# EAGLE design fb_in_8_230V_03 (EAGLE 4.16)
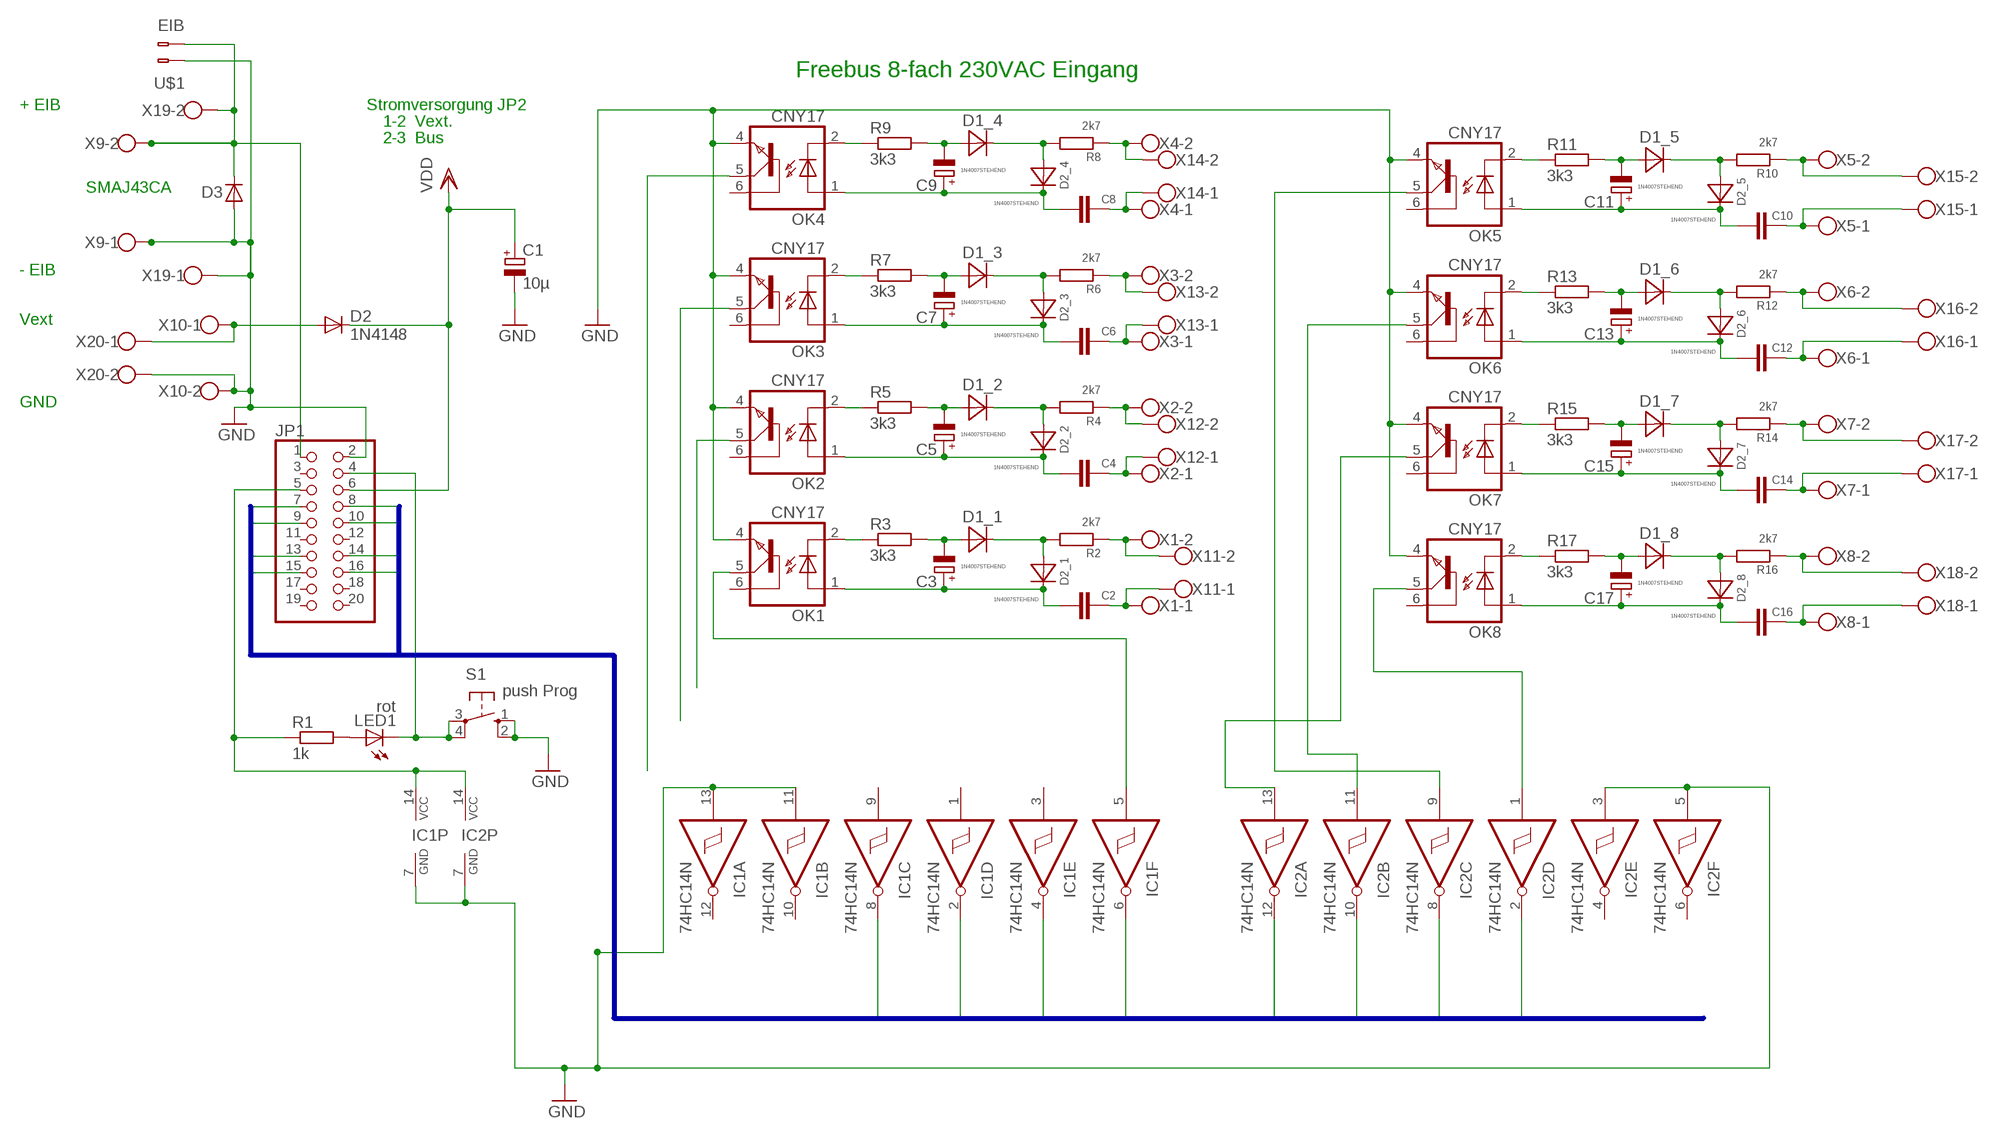
[diagram p0: schematic, sheet 1]

## Parts
C1  10µ  CPOL-EUE3.5-8  [E3,5-8]
C2  C-EU075-063X106  [C075-063X106]
C3  CPOL-EUE2-4  [E2-4]
C4  C-EU075-063X106  [C075-063X106]
C5  CPOL-EUE2-4  [E2-4]
C6  C-EU075-063X106  [C075-063X106]
C7  CPOL-EUE2-4  [E2-4]
C8  C-EU075-063X106  [C075-063X106]
C9  CPOL-EUE2-4  [E2-4]
C10  C-EU075-063X106  [C075-063X106]
C11  CPOL-EUE2-4  [E2-4]
C12  C-EU075-063X106  [C075-063X106]
C13  CPOL-EUE2-4  [E2-4]
C14  C-EU075-063X106  [C075-063X106]
C15  CPOL-EUE2-4  [E2-4]
C16  C-EU075-063X106  [C075-063X106]
C17  CPOL-EUE2-4  [E2-4]
D1_1  1N4007STEHEND  [RAD2,5]
D1_2  1N4007STEHEND  [RAD2,5]
D1_3  1N4007STEHEND  [RAD2,5]
D1_4  1N4007STEHEND  [RAD2,5]
D1_5  1N4007STEHEND  [RAD2,5]
D1_6  1N4007STEHEND  [RAD2,5]
D1_7  1N4007STEHEND  [RAD2,5]
D1_8  1N4007STEHEND  [RAD2,5]
D2  1N4148  [DO35-10]
D2_1  1N4007STEHEND  [RAD2,5]
D2_2  1N4007STEHEND  [RAD2,5]
D2_3  1N4007STEHEND  [RAD2,5]
D2_4  1N4007STEHEND  [RAD2,5]
D2_5  1N4007STEHEND  [RAD2,5]
D2_6  1N4007STEHEND  [RAD2,5]
D2_7  1N4007STEHEND  [RAD2,5]
D2_8  1N4007STEHEND  [RAD2,5]
D3  D-  [SMA]
IC1  74HC14N  [DIL14]
IC2  74HC14N  [DIL14]
JP1  PINHD-2X10  [2X10]
LED1  rot  LED3MM  [LED3MM]
OK1  CNY17  [DIL06]
OK2  CNY17  [DIL06]
OK3  CNY17  [DIL06]
OK4  CNY17  [DIL06]
OK5  CNY17  [DIL06]
OK6  CNY17  [DIL06]
OK7  CNY17  [DIL06]
OK8  CNY17  [DIL06]
R1  1k  R-EU_0204/7  [0204/7]
R2  2k7  R-EU_0207/2V  [0207/2V]
R3  3k3  R-EU_0207/2V  [0207/2V]
R4  2k7  R-EU_0207/2V  [0207/2V]
R5  3k3  R-EU_0207/2V  [0207/2V]
R6  2k7  R-EU_0207/2V  [0207/2V]
R7  3k3  R-EU_0207/2V  [0207/2V]
R8  2k7  R-EU_0207/2V  [0207/2V]
R9  3k3  R-EU_0207/2V  [0207/2V]
R10  2k7  R-EU_0207/2V  [0207/2V]
R11  3k3  R-EU_0207/2V  [0207/2V]
R12  2k7  R-EU_0207/2V  [0207/2V]
R13  3k3  R-EU_0207/2V  [0207/2V]
R14  2k7  R-EU_0207/2V  [0207/2V]
R15  3k3  R-EU_0207/2V  [0207/2V]
R16  2k7  R-EU_0207/2V  [0207/2V]
R17  3k3  R-EU_0207/2V  [0207/2V]
S1  push Prog  10-XX  [B3F-10XX]
U$1  EIB  [BUSKLEMME243-724]
X1  W237-102W2POL5_08  [W237-132]
X2  W237-102W2POL5_08  [W237-132]
X3  W237-102W2POL5_08  [W237-132]
X4  W237-102W2POL5_08  [W237-132]
X5  W237-102W2POL5_08  [W237-132]
X6  W237-102W2POL5_08  [W237-132]
X7  W237-102W2POL5_08  [W237-132]
X8  W237-102W2POL5_08  [W237-132]
X9  W237-102W2POL5_08  [W237-132]
X10  W237-102W2POL5_08  [W237-132]
X11  W237-102AKL007-2P  [AKL007-02]
X12  W237-102AKL007-2P  [AKL007-02]
X13  W237-102AKL007-2P  [AKL007-02]
X14  W237-102AKL007-2P  [AKL007-02]
X15  W237-102AKL007-2P  [AKL007-02]
X16  W237-102AKL007-2P  [AKL007-02]
X17  W237-102AKL007-2P  [AKL007-02]
X18  W237-102AKL007-2P  [AKL007-02]
X19  W237-102AKL007-2P  [AKL007-02]
X20  W237-102AKL007-2P  [AKL007-02]

## Nets
230+_1: C2.1 C3.+ D2_1.C OK1.1(A)
230+_2: C4.1 C5.+ D2_2.C OK2.1(A)
230+_3: C6.1 C7.+ D2_3.C OK3.1(A)
230+_4: C8.1 C9.+ D2_4.C OK4.1(A)
230+_5: C10.1 C11.+ D2_5.C OK5.1(A)
230+_6: C12.1 C13.+ D2_6.C OK6.1(A)
230+_7: C14.1 C15.+ D2_7.C OK7.1(A)
230+_8: C16.1 C17.+ D2_8.C OK8.1(A)
230-_1: C3.- D1_1.A R3.2
230-_2: C5.- D1_2.A R5.2
230-_3: C7.- D1_3.A R7.2
230-_4: C9.- D1_4.A R9.2
230-_5: C11.- D1_5.A R11.2
230-_6: C13.- D1_6.A R13.2
230-_7: C15.- D1_7.A R15.2
230-_8: C17.- D1_8.A R17.2
230N_1: D1_1.C D2_1.A R2.2
230N_2: D1_2.C D2_2.A R4.2
230N_3: D1_3.C D2_3.A R6.2
230N_4: D1_4.C D2_4.A R8.2
230N_5: D1_5.C D2_5.A R10.2
230N_6: D1_6.C D2_6.A R12.2
230N_7: D1_7.C D2_7.A R14.2
230N_8: D1_8.C D2_8.A R16.2
GND: C1.- D3.2(A) IC1.7(P:GND) IC1.11(B:I) IC1.13(A:I) IC2.3(E:I) IC2.5(F:I) IC2.7(P:GND) JP1.2 OK1.4(EMI) OK2.4(EMI) OK3.4(EMI) OK4.4(EMI) OK5.4(EMI) OK6.4(EMI) OK7.4(EMI) OK8.4(EMI) S1.1(S) S1.2(S1) U$1.1(B-1) X9.1 X10.2 X19.1 X20.2
IO1: IC1.6(F:O) JP1.16
IO2: IC1.4(E:O) JP1.15
IO3: IC1.2(D:O) JP1.14
IO4: IC1.8(C:O) JP1.13
IO5: IC2.8(C:O) JP1.10
IO6: IC2.10(B:O) JP1.9
IO7: IC2.12(A:O) JP1.8
IO8: IC2.2(D:O) JP1.7
N$1: C8.2 X4.1 X14.1
N$2: R8.1 X4.2 X14.2
N$3: C6.2 X3.1 X13.1
N$4: R6.1 X3.2 X13.2
N$5: C4.2 X2.1 X12.1
N$6: R4.1 X2.2 X12.2
N$7: C2.2 X1.1 X11.1
N$8: R2.1 X1.2 X11.2
N$9: R12.1 X6.2 X16.2
N$10: C12.2 X6.1 X16.1
N$11: R14.1 X7.2 X17.2
N$12: C16.2 X8.1 X18.1
N$13: R10.1 X5.2 X15.2
N$14: C10.2 X5.1 X15.1
N$15: C14.2 X7.1 X17.1
N$16: R16.1 X8.2 X18.2
N$17: D2.A X10.1 X20.1
N$18: IC2.9(C:I) OK5.5(COL)
N$19: IC2.11(B:I) OK6.5(COL)
N$20: D3.1(C) JP1.1 U$1.2(B-2) X9.2 X19.2
N$21: IC2.13(A:I) OK7.5(COL)
N$22: IC2.1(D:I) OK8.5(COL)
N$23: IC1.5(F:I) OK1.5(COL)
N$24: IC1.14(P:VCC) IC2.14(P:VCC) JP1.5 R1.1
N$25: OK2.5(COL)
N$27: JP1.4 LED1.K(C) S1.3(P) S1.4(P1)
N$28: LED1.A R1.2
N$29: OK3.5(COL)
N$30: OK4.5(COL)
OPT_1: OK1.2(C) R3.1
OPT_2: OK2.2(C) R5.1
OPT_3: OK3.2(C) R7.1
OPT_4: OK4.2(C) R9.1
OPT_5: OK5.2(C) R11.1
OPT_6: OK6.2(C) R13.1
OPT_7: OK7.2(C) R15.1
OPT_8: OK8.2(C) R17.1
VDD: C1.+ D2.C JP1.6
Unconnected: IC1.1(D:I) IC1.3(E:I) IC1.9(C:I) IC1.10(B:O) IC1.12(A:O) IC2.4(E:O) IC2.6(F:O) JP1.3 JP1.11 JP1.12 JP1.17 JP1.18 JP1.19 JP1.20 OK1.6(BAS) OK2.6(BAS) OK3.6(BAS) OK4.6(BAS) OK5.6(BAS) OK6.6(BAS) OK7.6(BAS) OK8.6(BAS)

## Buses
IO[1..8]

## Notes on the sheet
- Freebus 8-fach 230VAC Eingang
- + EIB | Stromversorgung JP2
- 1-2  Vext.
- 2-3  Bus
- SMAJ43CA
- - EIB
- Vext
- GND

## Library data of the parts
C1 C3 C5 C7 C9 C11 C13 C15 C17 = rcl:CPOL-EU: POLARIZED CAPACITOR, European symbol
C2 C4 C6 C8 C10 C12 C14 C16 = rcl:C-EU: CAPACITOR, European symbol
D1_1-D1_8 D2_1-D2_8 = diode:1N4007
D2 = diode:1N4148: DIODE high speed (Philips)
D3 = semicon-smd-ipc:D-: DIODE unfilled
IC1 IC2 = 74xx-eu:74*14: Hex schmitt trigger INVERTER
JP1 = pinhead:PINHD-2X10: PIN HEADER
LED1 = led:LED: LED OSRAM: - CHIPLED LG R971, LG N971, LY N971, LG Q971, LY Q971, LO R971, LY R971 LH N974, LH R974 LS Q976, LO Q976, LY Q976 LO Q996 - Hyper CHIPLED LW Q18S LB Q993, LB Q99A, LB R99A - SideLED LS A670, LO A670, LY A670, LG A670, LP A670 LB A673, LV A673, LT A673, LW A673 LH A674 LY A675 LS A676, LA A676, LO A676, LY A676, LW A676 LS A679, LY A679, LG A679 - Hyper Micro SIDELED® LS Y876, LA Y876, LO Y876, LY Y876 LT Y87S - SmartLED LW L88C, LW L88S LB L89C, LB L89S, LG L890 LS L89K, LO L89K, LY L89K LS L896, LA L896, LO L896, LY L896 - TOPLED LS T670, LO T670, LY T670, LG T670, LP T670 LSG T670, LSP T670, LSY T670, LOP T670, LYG T670 LG T671, LOG T671, LSG T671 LB T673, LV T673, LT T673, LW T673 LH T674 LS T676, LA T676, LO T676, LY T676, LB T676, LH T676, LSB T676, LW T676 LB T67C, LV T67C, LT T67C, LS T67K, LO T67K, LY T67K, LW E67C LS E67B, LA E67B, LO E67B, LY E67B, LB E67C, LV E67C, LT E67C LW T67C LS T679, LY T679, LG T679 LS T770, LO T770, LY T770, LG T770, LP T770 LB T773, LV T773, LT T773, LW T773 LH T774 LS E675, LA E675, LY E675, LS T675 LS T776, LA T776, LO T776, LY T776, LB T776 LHGB T686 LT T68C, LB T68C - Hyper Mini TOPLED® LB M676 - Mini TOPLED Santana® LG M470 LS M47K, LO M47K, LY M47K Source: http://www.osram.convergy.de - LUMILED® LXK2-PW12-R00, LXK2-PW12-S00, LXK2-PW14-U00, LXK2-PW14-V00 LXK2-PM12-R00, LXK2-PM12-S00, LXK2-PM14-U00 LXK2-PE12-Q00, LXK2-PE12-R00, LXK2-PE12-S00, LXK2-PE14-T00, LXK2-PE14-U00 LXK2-PB12-K00, LXK2-PB12-L00, LXK2-PB12-M00, LXK2-PB14-N00, LXK2-PB14-P00, LXK2-PB14-Q00 LXK2-PR12-L00, LXK2-PR12-M00, LXK2-PR14-Q00, LXK2-PR14-R00 LXK2-PD12-Q00, LXK2-PD12-R00, LXK2-PD12-S00 LXK2-PH12-R00, LXK2-PH12-S00 LXK2-PL12-P00, LXK2-PL12-Q00, LXK2-PL12-R00 Source: www.luxeon.com
OK1-OK8 = optocoupler:CNY17: SIEMENS OPTO COUPLER
R1-R17 = rcl:R-EU_: RESISTOR, European symbol
S1 = switch-omron:10-XX: OMRON SWITCH
U$1 = con-wago:EIB
X1-X20 = con-wago-500:W237-102: WAGO SCREW CLAMP

## Board
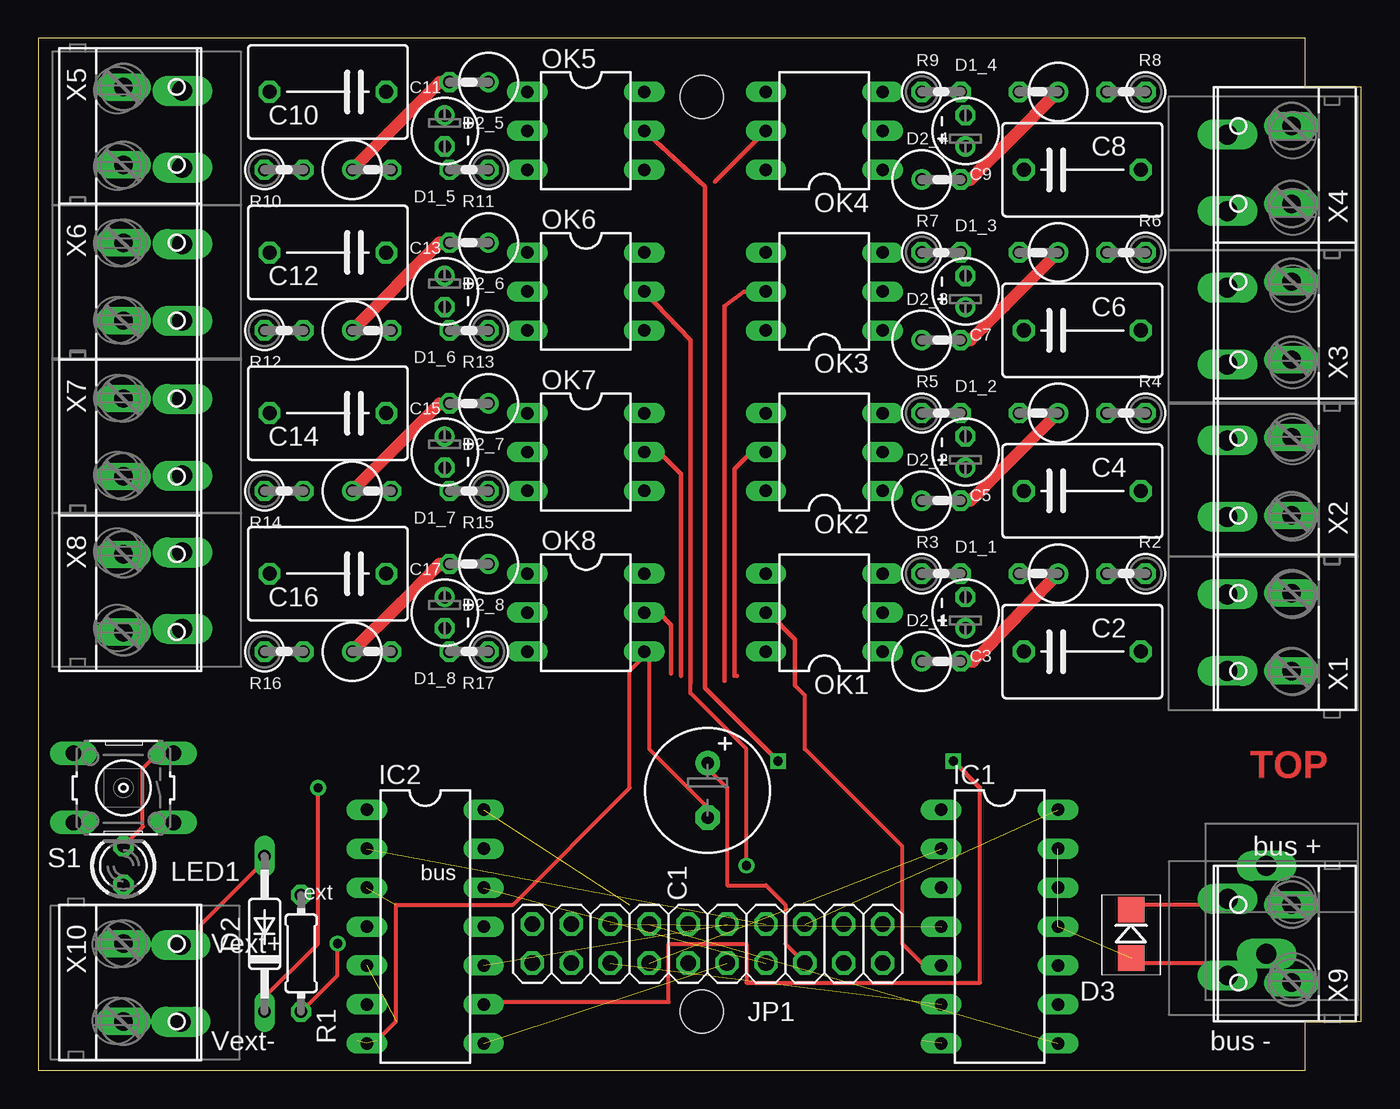
[diagram p1: board, top side]
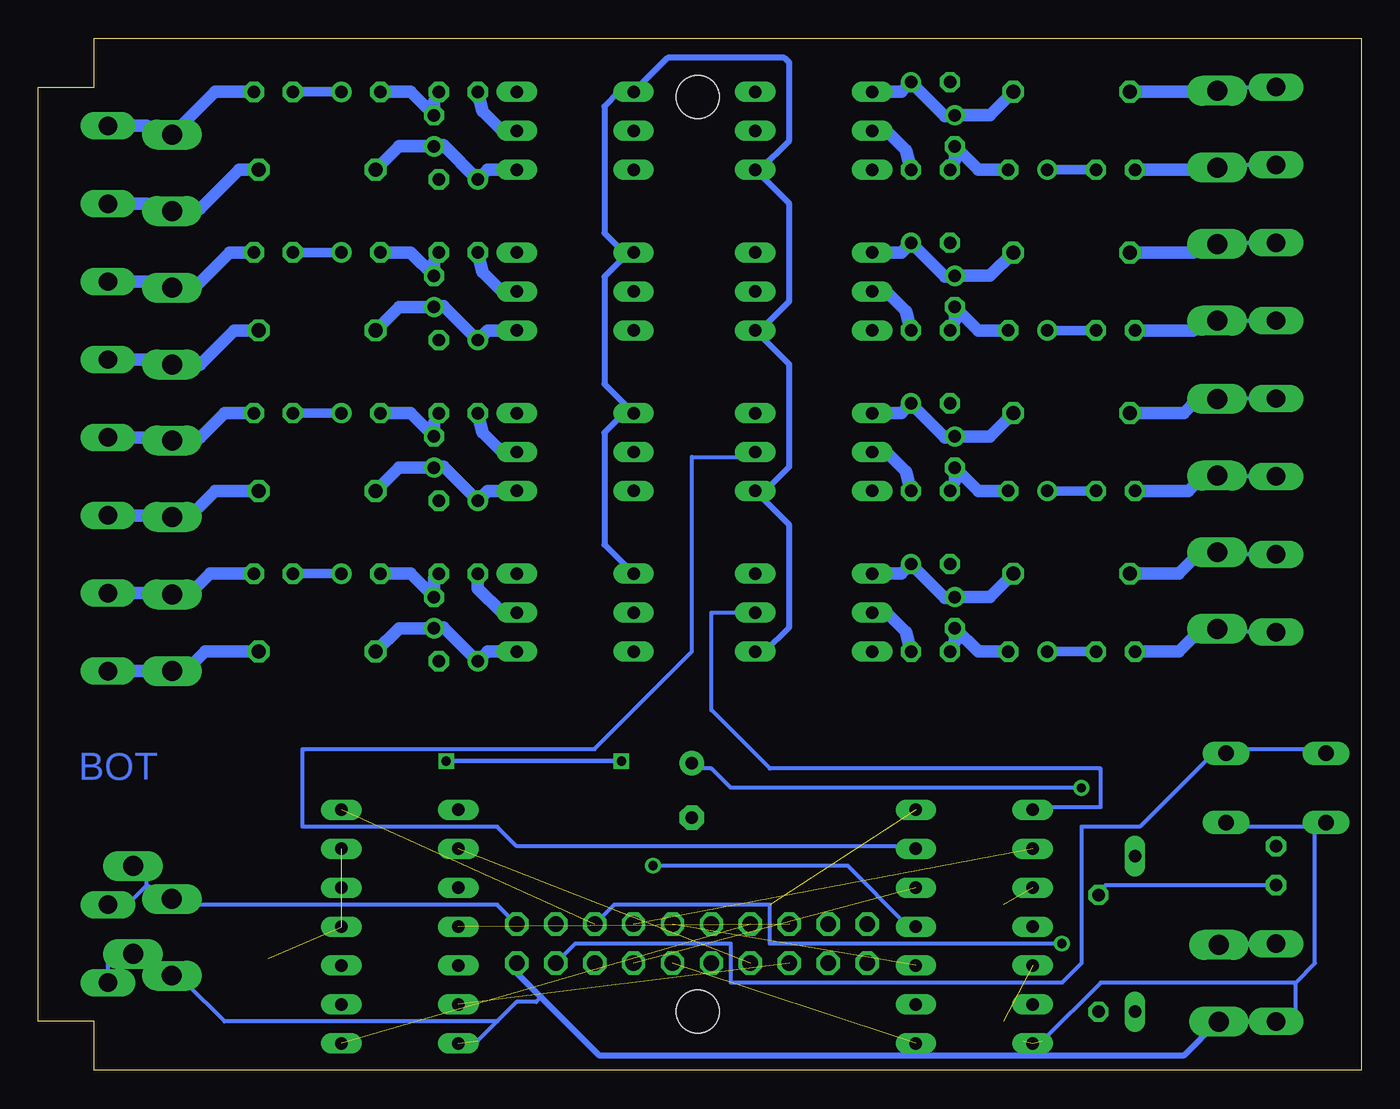
[diagram p2: board, bottom side, seen from below]

Size 86.28 x 67.31 mm. Coordinates in mm from the lower left corner, seen from the top.
Outline: 0,0.01 82.64,0 82.64,3.18 86.28,3.18 86.28,64.13 82.64,64.13 82.64,67.31 0,67.31 0,0.01
Copper layers (1*16): Top 0.035mm / dielectric 1.5mm / Bottom 0.035mm
Design rules "default": minimum track width 10mil, minimum drill 24mil, track to track 16mil, track to pad 12mil, pad to pad 16mil, via to via 16mil, smd to smd 8mil, copper to edge 20mil, drill to drill 10mil, minimum pad ring 10mil, minimum via ring 8mil, stop-mask expansion 4mil, vias tented up to drill 0mil, thermal gap 10mil
Holes 2.8 mm at 43.27,3.81 43.27,63.5
tRestrict: area 36,20.3 to 37.3,67.3; area 57,22.2 to 58.3,69.2
bRestrict: area 57,22.2 to 58.3,69.2; area 36,20.3 to 37.3,67.3

### Footprints (pad centres in the part's own frame; a part is rotated, then mirrored left to right if it is on the bottom)
E3,5-8 = drill 0.813 pad 1.6 round: + -1.778,0 | drill 0.813 pad 1.6 octagon: - 1.778,0
C075-063X106 = drill 0.914 octagon: 1 -3.81,0; 2 3.81,0
E2-4 = drill 0.813 pad 1.27 round: + -1.016,0 | drill 0.813 pad 1.27 octagon: - 1.016,0
RAD2,5 = drill 0.813 octagon: A 1.27,0 | drill 0.813 round: C -1.27,0
DO35-10 = drill 0.813 long: A 5.08,0; C -5.08,0
SMA = smd 1.67 x 1.73: 1 -1.576,0; 2 1.58,0.014
DIL14 = drill 0.813 long: 1 -7.62,-3.81; 2 -5.08,-3.81; 3 -2.54,-3.81; 4 0,-3.81; 5 2.54,-3.81; 6 5.08,-3.81; 7 7.62,-3.81; 8 7.62,3.81; 9 5.08,3.81; 10 2.54,3.81; 11 0,3.81; 12 -2.54,3.81; 13 -5.08,3.81; 14 -7.62,3.81
2X10 = drill 1.016 octagon: 1 -11.43,-1.27; 2 -11.43,1.27; 3 -8.89,-1.27; 4 -8.89,1.27; 5 -6.35,-1.27; 6 -6.35,1.27; 7 -3.81,-1.27; 8 -3.81,1.27; 9 -1.27,-1.27; 10 -1.27,1.27; 11 1.27,-1.27; 12 1.27,1.27; 13 3.81,-1.27; 14 3.81,1.27; 15 6.35,-1.27; 16 6.35,1.27; 17 8.89,-1.27; 18 8.89,1.27; 19 11.43,-1.27; 20 11.43,1.27
LED3MM = drill 0.813 octagon: A -1.27,0; K 1.27,0
DIL06 = drill 0.813 long: 1 -2.54,-3.81; 2 0,-3.81; 3 2.54,-3.81; 4 2.54,3.81; 5 0,3.81; 6 -2.54,3.81
0204/7 = drill 0.813 octagon: 1 -3.81,0; 2 3.81,0
0207/2V = drill 0.813 octagon: 1 -1.27,0; 2 1.27,0
B3F-10XX = drill 1.016 long: 1 -3.251,2.261; 2 3.251,2.261; 3 -3.251,-2.261; 4 3.251,-2.261
BUSKLEMME243-724 = drill 1.3 long: 1 -2.875,0; 2 2.875,0
W237-132 = drill 1.194 long: 1 -2.54,-0.635; 2 2.54,-0.635
AKL007-02 = drill 1.3 long: 1 -2.45,2.325; 2 2.55,2.325

### Placement (x,y rotation side)
C1  43.65,18.26 270 top
C2  68.1,27.31 0 top
C3  60.48,29.85 90 top
C4  68.1,37.78 0 top
C5  60.48,40.32 90 top
C6  68.1,48.26 0 top
C7  60.48,50.8 90 top
C8  68.1,58.74 0 top
C9  60.48,61.28 90 top
C10  18.88,63.82 180 top
C11  26.5,61.28 270 top
C12  18.88,53.34 180 top
C13  26.5,50.8 270 top
C14  18.88,42.86 180 top
C15  26.5,40.32 270 top
C16  18.88,32.38 180 top
C17  26.5,29.85 270 top
D1_1  65.24,32.38 180 top
D1_2  65.24,42.86 180 top
D1_3  65.24,53.34 180 top
D1_4  65.24,63.82 180 top
D1_5  21.74,58.74 0 top
D1_6  21.74,48.26 0 top
D1_7  21.74,37.78 0 top
D1_8  21.74,27.31 0 top
D2  14.76,8.89 90 top
D2_1  58.89,26.67 0 top
D2_2  58.89,37.15 0 top
D2_3  58.89,47.62 0 top
D2_4  58.89,58.1 0 top
D2_5  28.09,64.45 180 top
D2_6  28.09,53.98 180 top
D2_7  28.09,43.5 180 top
D2_8  28.09,33.02 180 top
D3  71.27,8.89 270 top
IC1  62.7,9.37 270 top
IC2  25.23,9.37 270 top
JP1  43.65,8.26 180 top
LED1  5.55,13.33 90 top
OK1  51.27,29.85 90 top
OK2  51.27,40.32 90 top
OK3  51.27,50.8 90 top
OK4  51.27,61.28 90 top
OK5  35.71,61.28 270 top
OK6  35.71,50.8 270 top
OK7  35.71,40.32 270 top
OK8  35.71,29.85 270 top
R1  17.14,7.62 90 top
R2  70.95,32.38 180 top
R3  58.89,32.38 0 top
R4  70.95,42.86 180 top
R5  58.89,42.86 0 top
R6  70.95,53.34 180 top
R7  58.89,53.34 0 top
R8  70.95,63.82 180 top
R9  58.89,63.82 0 top
R10  16.03,58.74 0 top
R11  28.09,58.74 180 top
R12  16.03,48.26 0 top
R13  28.09,48.26 180 top
R14  16.03,37.78 0 top
R15  28.09,37.78 180 top
R16  16.03,27.31 0 top
R17  28.09,27.31 180 top
S1  5.55,18.42 180 top
U$1  80.11,10.45 90 top
X1  81.11,28.58 90 top
X2  81.11,38.73 90 top
X3  81.11,48.89 90 top
X4  81.11,59.05 90 top
X5  6.18,61.59 270 top
X6  6.18,51.43 270 top
X7  6.18,41.27 270 top
X8  6.18,31.12 270 top
X9  81.11,8.26 90 top
X10  6.18,5.71 270 top
X11  79.89,28.49 90 top
X12  79.89,38.53 90 top
X13  79.89,48.49 90 top
X14  79.89,58.49 90 top
X15  7.07,61.43 270 top
X16  7.07,51.43 270 top
X17  7.07,41.34 270 top
X18  7.07,31.34 270 top
X19  79.9,8.62 90 top
X20  6.96,5.71 270 top

### Tracks (layer width: path | path; a pad name or v marks a point on that pad's centre or on a via)
230+_1
  Bottom 0.813: OK1.1 56.98,27.31 D2_1.C 59.84,28.89 60.48,28.89 C3.+ 62.76,28.83 C2.1
230+_2
  Bottom 0.813: OK2.1 56.98,37.78 D2_2.C 59.84,39.37 60.48,39.37 C5.+ 62.76,39.31 C4.1
230+_3
  Bottom 0.813: OK3.1 56.98,48.26 D2_3.C 59.84,49.85 60.48,49.85 C7.+ 62.76,49.78 C6.1
230+_4
  Bottom 0.813: OK4.1 56.98,58.74 D2_4.C 59.84,60.32 60.48,60.32 C9.+ 62.76,60.26 C8.1
230+_5
  Bottom 0.813: OK5.1 30,63.82 D2_5.C 27.14,62.23 26.5,62.23 C11.+ 24.22,62.29 C10.1
230+_6
  Bottom 0.813: OK6.1 30,53.34 D2_6.C 27.14,51.75 26.5,51.75 C13.+ 24.22,51.82 C12.1
230+_7
  Bottom 0.813: OK7.1 30,42.86 D2_7.C 27.14,41.27 26.5,41.27 C15.+ 24.22,41.34 C14.1
230+_8
  Bottom 0.813: OK8.1 30,32.38 D2_8.C 27.14,30.8 26.5,30.8 C17.+ 24.22,30.86 C16.1
230-_1
  Bottom 0.813: C3.- 60.48,30.8 | R3.2 60.48,32.07 C3.- | C3.- 62,32.38 D1_1.A
230-_2
  Bottom 0.813: C5.- 60.48,41.27 | R5.2 60.48,42.23 C5.- | C5.- 62,42.86 D1_2.A
230-_3
  Bottom 0.813: C7.- 60.48,51.75 | R7.2 60.48,52.7 C7.- | C7.- 62,53.34 D1_3.A
230-_4
  Bottom 0.813: C9.- 60.48,62.23 | R9.2 60.48,63.18 C9.- | C9.- 62,63.82 D1_4.A
230-_5
  Bottom 0.813: C11.- 26.5,60.32 | R11.2 26.5,59.37 C11.- | C11.- 24.98,58.74 D1_5.A
230-_6
  Bottom 0.813: C13.- 26.5,49.85 | R13.2 26.5,48.89 C13.- | C13.- 24.98,48.26 D1_6.A
230-_7
  Bottom 0.813: C15.- 26.5,39.37 | R15.2 26.5,38.42 C15.- | C15.- 24.98,37.78 D1_7.A
230-_8
  Bottom 0.813: C17.- 26.5,28.89 | R17.2 26.5,27.94 C17.- | C17.- 24.98,27.31 D1_8.A
230N_1
  Top 0.813: D2_1.A 60.32,26.67 | 60.32,26.67 60.8,26.67 | 60.32,26.67 60.95,26.67 61.91,27.62 D1_1.C
  Bottom 0.61: D1_1.C R2.2
230N_2
  Top 0.813: D2_2.A 60.8,37.15 61.27,37.62 62.06,38.42 D1_2.C
  Bottom 0.61: D1_2.C R4.2
230N_3
  Top 0.813: D2_3.A 60.8,47.62 61.11,47.94 61.59,48.42 63.02,49.85 D1_3.C
  Bottom 0.61: D1_3.C R6.2
230N_4
  Top 0.813: D2_4.A 60.8,58.1 61.75,59.05 63.34,60.64 D1_4.C
  Bottom 0.61: D1_4.C R8.2
230N_5
  Top 0.813: D2_5.A 26.19,64.45 25.39,63.66 24.44,62.71 22.85,61.12 D1_5.C
  Bottom 0.61: R10.2 D1_5.C
230N_6
  Top 0.813: D2_6.A 26.19,53.98 D1_6.C
  Bottom 0.61: R12.2 D1_6.C
230N_7
  Top 0.813: D2_7.A 26.19,43.5 D1_7.C
  Bottom 0.61: R14.2 D1_7.C
230N_8
  Top 0.813: D2_8.A 26.19,33.02 24.76,31.59 23.65,30.48 D1_8.C
  Bottom 0.61: R16.2 D1_8.C
GND  (7 unrouted)
  Top 0.254: D3.2 71.59,6.98 76.67,6.98 X19.1 | 39.84,27.31 39.84,20.96 43.65,17.15 C1.- | 39.84,27.31 38.57,26.04 38.57,18.42 30.95,10.79 23.33,10.79 23.33,3.17 22.06,1.91 | 39.84,27.31 OK8.4
  Bottom 0.254: X9.1 81.75,6.98 U$1.1 79.21,6.98 X19.1 76.67,5.71 74.13,3.17 56.35,3.17 | 3.01,15.88 8.09,15.88 S1.1 9.36,15.88 | 4.28,5.71 4.28,3.17 X10.2 8.09,3.17 X20.2 9.36,3.17 | 4.28,5.71 3.01,6.98 3.01,15.88 | 3.01,15.88 S1.2 | 56.35,3.17 55.08,4.45 53.81,4.45 53.49,4.76 | 56.35,3.17 57.62,1.91 | 20.79,1.91 16.98,5.71 4.28,5.71
  Bottom 0.406: 9.36,3.17 11.58,0.95 49.68,0.95 53.49,4.76 55.08,6.35 JP1.2 | OK8.4 39.52,27.62 39.2,27.31 38.89,27.31 37.3,28.89 37.3,35.56 OK7.4 38.89,37.78 37.3,39.37 37.3,46.04 OK6.4 39.2,48.26 37.3,50.16 37.3,56.52 OK5.4 39.2,58.74 37.3,60.64 37.3,65.72 37.62,66.04 45.24,66.04 OK4.4 48.41,63.82 49.37,62.86 49.37,54.61 48.09,53.34 47.78,53.34 | 47.78,53.34 OK3.4 | 47.78,53.34 49.37,51.75 49.37,44.77 OK2.4 48.09,42.86 49.37,41.59 49.37,34.29 OK1.4
IO1  (1 unrouted)
IO2  (1 unrouted)
IO3  (1 unrouted)
IO4  (1 unrouted)
IO5  (1 unrouted)
IO6  (1 unrouted)
IO7  (1 unrouted)
IO8  (1 unrouted)
N$1
  Bottom 0.254: X14.1 79.21,56.52
  Bottom 0.406: X14.1 77.47,56.04 77.3,56.2 75.72,56.2
  Bottom 0.813: 79.21,56.52 X4.1 | C8.2 73.18,58.74 75.72,56.2
N$2
  Bottom 0.254: X14.2 79.21,61.59
  Bottom 0.406: 77.62,60.96 77.56,61.02 X14.2
  Bottom 0.813: 79.21,61.59 X4.2 | R8.1 74.77,63.82 77.56,61.02
N$3
  Bottom 0.254: X13.1 79.21,46.35
  Bottom 0.406: 77.62,46.04 X13.1 75.72,46.04
  Bottom 0.813: 79.21,46.35 X3.1 | C6.2 73.5,48.26 75.72,46.04
N$4
  Bottom 0.254: X13.2 79.21,51.43
  Bottom 0.406: X13.2 77.56,51.06 77.62,51.12 76.03,51.12
  Bottom 0.813: 79.21,51.43 X3.2 | R6.1 73.81,53.34 76.03,51.12
N$5
  Bottom 0.254: X12.1 79.21,36.2
  Bottom 0.406: X12.1 77.56,36.14 77.62,36.2 77.3,36.51 76.03,36.51
  Bottom 0.813: 79.21,36.2 X2.1 | C4.2 74.77,37.78 76.03,36.51
N$6
  Bottom 0.254: X12.2 79.21,41.27
  Bottom 0.406: X12.2 77.56,41.22 77.62,41.27 75.72,41.27
  Bottom 0.813: 79.21,41.27 X2.2 | R4.1 74.13,42.86 75.72,41.27
N$7
  Bottom 0.254: X11.1 79.21,26.04
  Bottom 0.406: X11.1 77.62,26.04 76.67,26.04
  Bottom 0.813: 79.21,26.04 X1.1 | C2.2 75.4,27.31 76.67,26.04
N$8
  Bottom 0.254: X11.2 79.21,31.12
  Bottom 0.406: X11.2 77.56,31.06 77.62,31.12 76.35,31.12
  Bottom 0.813: 79.21,31.12 X1.2 | R2.1 75.08,32.38 76.35,31.12
N$9
  Bottom 0.254: X6.2 8.09,48.89 X16.2
  Bottom 0.406: X16.2
  Bottom 0.813: R12.1 10.95,48.26 10.63,48.58 9.68,48.58 9.37,48.88 | 9.37,48.88 9.36,48.89 | X16.2 9.37,48.88
N$10
  Bottom 0.254: X6.1 8.09,53.98 X16.1
  Bottom 0.406: X16.1 9.49,53.98
  Bottom 0.813: C12.2 10.95,53.34 10.31,53.98 9.36,53.98 9.4,53.94 X16.1
N$11
  Bottom 0.254: X7.2 8.09,38.73 X17.2
  Bottom 0.406: X17.2 9.45,38.73
  Bottom 0.813: R14.1 11.27,37.78 10.63,38.42 9.68,38.42 9.36,38.73 9.4,38.77 X17.2
N$12
  Bottom 0.254: X8.1 8.09,33.66 X18.1
  Bottom 0.406: X18.1 9.58,33.97
  Bottom 0.813: C16.2 11.9,32.38 10.95,33.34 9.68,33.34 9.36,33.66 9.4,33.69 X18.1
N$13
  Bottom 0.254: X5.2 8.09,59.05 X15.2
  Bottom 0.406: X15.2 9.57,59.05
  Bottom 0.813: 9.4,59.02 9.36,59.05 | X15.2 9.4,59.02 | R10.1 9.68,58.74 9.4,59.02
N$14
  Bottom 0.254: X5.1 8.09,64.14 X15.1
  Bottom 0.406: X15.1 9.65,64.14
  Bottom 0.813: X15.1 9.4,63.85 9.36,63.82 C10.2
N$15
  Bottom 0.254: X7.1 8.09,43.81 X17.1
  Bottom 0.406: X17.1 9.43,43.81
  Bottom 0.813: C14.2 11.58,42.86 10.95,43.5 9.68,43.5 X17.1 | X17.1 9.36,43.81 | X17.1
N$16
  Bottom 0.254: X8.2 8.09,28.58 X18.2
  Bottom 0.406: X18.2 9.5,28.89
  Bottom 0.813: R16.1 11.9,27.31 10.95,28.26 9.68,28.26 9.36,28.58 9.4,28.61 X18.2
N$17
  Top 0.254: D2.A 14.44,13.33 10.63,9.53 10.63,8.26 X20.1
  Bottom 0.254: 10.63,8.26 X20.1 8.09,8.26 X10.1
N$18  (via drill 0.6)
  Top 0.254: 61.43,18.42 61.43,5.71 46.19,5.71 46.19,8.26 41.11,8.26 41.11,4.45 29.68,4.45 IC2.9
  Top 0.305: OK5.5 42.18,58.84 43.49,57.63 43.49,24.92 v48.25,20.16 | 61.43,18.42 v59.68,20.16
  Bottom 0.305: v48.25,20.16 v59.68,20.16
N$19  (via drill 0.61)
  Top 0.254: v46.19,13.33 46.19,20.96 42.54,24.61 42.54,25.24
  Top 0.305: OK6.5 42.54,47.62 42.54,25.24
  Bottom 0.254: v46.19,13.33 33.49,13.33 29.68,9.53 IC2.11
N$20
  Top 0.254: D3.1 71.59,10.79 76.67,10.79 X19.2
  Bottom 0.254: 79.21,12.06 80.48,10.79 X9.2 | 79.21,12.06 79.21,13.33 U$1.2 | 79.21,12.06 X19.2 76.67,10.79 56.35,10.79 JP1.1
N$21
  Top 0.305: 40.48,40.32 41.9,38.89 41.9,25.72
  Top 0.406: OK7.5 40.48,40.32
  Bottom 0.254: IC2.13 29.68,14.61 55.08,14.61 56.35,15.88 69.05,15.88 69.05,20.96 50,20.96 43.65,27.31 43.65,40 39.84,40 OK7.5
N$22
  Top 0.254: OK8.5 40.48,29.85
  Top 0.305: 40.48,29.85 41.27,29.05 41.27,25.88
  Bottom 0.254: IC2.1 20.79,17.15 16.98,17.15 16.98,19.69 38.57,19.69 42.38,23.5 42.38,29.85 OK8.5
N$23
  Top 0.254: IC1.5 57.78,6.83 56.35,8.26 56.35,14.61 50,20.96 50,24.45 49.37,25.08
  Top 0.305: OK1.5 47.62,29.85 49.37,28.1 49.37,25.08
N$24  (via drill 0.61)  (2 unrouted)
  Top 0.254: R1.1 19.52,6.19 v19.52,8.26 | R1.1
  Bottom 0.254: v19.52,8.26 38.57,8.26 38.57,10.79 48.73,10.79 JP1.5
N$25
  Top 0.254: 45.55,25.72 45.4,25.72
  Top 0.305: OK2.5 46.51,40.32 45.4,39.21 45.4,25.72 | 45.55,25.72
N$27
  Top 0.254: LED1.K 6.82,15.88 6.82,19.69 8.09,20.96 S1.3
  Bottom 0.254: S1.4 3.01,20.96 8.09,20.96 S1.3 9.36,20.96 14.44,15.88 18.25,15.88 18.25,6.98 19.52,5.71 41.11,5.71 41.11,8.26 51.27,8.26 JP1.4
N$28
  Bottom 0.254: LED1.A 16.66,12.06 R1.2
N$29
  Top 0.305: OK3.5 46.03,50.8 44.76,49.85 44.76,25.4
  Bottom 0.406: OK3.5 46.51,50.8
N$30
  Top 0.305: 44.13,57.94 OK4.5
  Bottom 0.406: OK4.5 47.14,61.28
OPT_1
  Bottom 0.813: OK1.2 56.03,29.85 57.62,31.43 R3.1
OPT_2
  Bottom 0.813: OK2.2 56.03,40.32 57.3,41.59 R5.1
OPT_3
  Bottom 0.813: OK3.2 56.03,50.8 57.3,52.07 R7.1
OPT_4
  Bottom 0.813: OK4.2 56.03,61.28 57.3,62.55 R9.1
OPT_5
  Bottom 0.813: OK5.2 30.95,61.28 29.68,60.01 R11.1
OPT_6
  Bottom 0.813: OK6.2 30.95,50.8 29.68,49.53 R13.1
OPT_7
  Bottom 0.813: OK7.2 30.95,40.32 29.68,39.05 R15.1
OPT_8
  Bottom 0.813: OK8.2 30.95,29.85 29.68,28.58 R17.1
VDD  (via drill 0.61)
  Top 0.254: v18.25,18.42 18.25,8.26 14.44,4.45 D2.C | JP1.6 48.73,8.26 48.73,10.79 47.46,12.06 44.92,12.06 44.92,18.42 43.65,19.69 C1.+
  Bottom 0.254: v18.25,18.42 41.11,18.42 42.38,19.69 43.65,19.69 C1.+

### Text on the board
Top: TOP
Bottom: BOT
tPlace: bus + | bus | ext | Vext+ | Vext- | bus -
tValues: fb_in_8_230V_02